# EAGLE design RN42_ BoB (EAGLE 5.10)
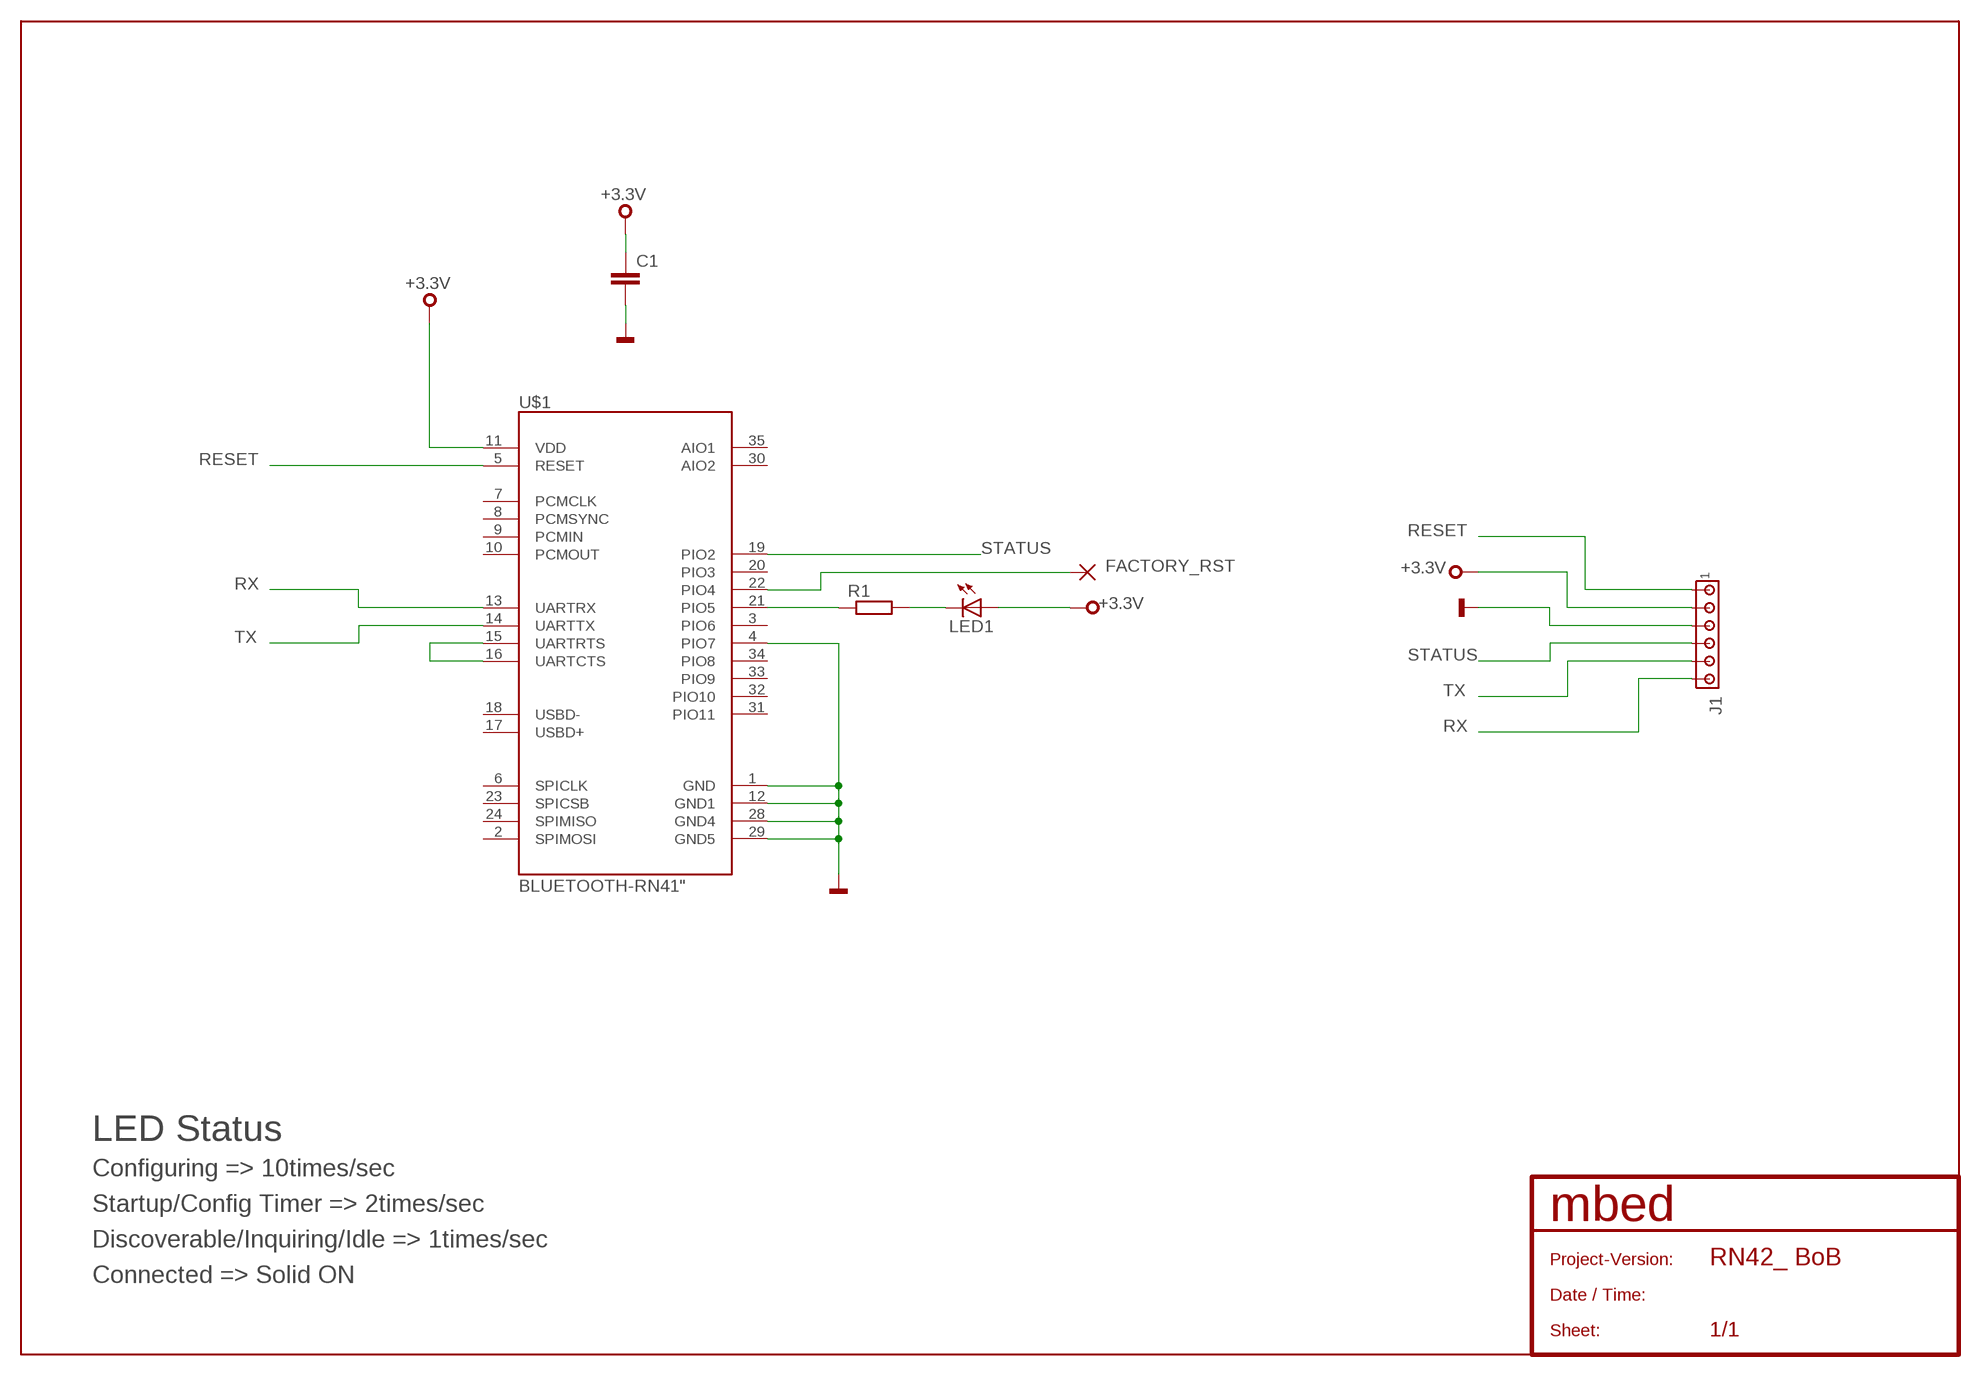
[diagram p0: schematic, sheet 1]

## Parts
C1  C-EUC0603  [C0603]
FACTORY_RST  WIREPADSMD1,27-254  [SMD1,27-2,54]
J1  MTA06-100  [10X06MTA]
LED1  LEDCHIP-LED0805  [CHIP-LED0805]
R1  R-EU_R0603  [R0603]
U$1  BLUETOOTH-RN41"  [RN41]

## Nets
+3,3V: C1.1 J1.5 LED1.A U$1.11(VDD) ; supply symbol labelled +3.3V
FACTORY_RST: FACTORY_RST.1(P) U$1.22(PIO4)
GND: C1.2 J1.4 U$1.1(GND) U$1.4(PIO7) U$1.12(GND1) U$1.28(GND4) U$1.29(GND5)
LINK: U$1.15(UARTRTS) U$1.16(UARTCTS)
N$1: LED1.C R1.2
N$2: R1.1 U$1.21(PIO5)
RESET: J1.6 U$1.5(RESET)
RX: J1.1 U$1.13(UARTRX)
STATUS: J1.3 U$1.19(PIO2)
TX: J1.2 U$1.14(UARTTX)
Unconnected: U$1.2(SPIMOSI) U$1.3(PIO6) U$1.6(SPICLK) U$1.7(PCMCLK) U$1.8(PCMSYNC) U$1.9(PCMIN) U$1.10(PCMOUT) U$1.17(USBD+) U$1.18(USBD-) U$1.20(PIO3) U$1.23(SPICSB) U$1.24(SPIMISO) U$1.30(AIO2) U$1.31(PIO11) U$1.32(PIO10) U$1.33(PIO9) U$1.34(PIO8) U$1.35(AIO1)

## Notes on the sheet
- LED Status
- Configuring => 10times/sec
- Startup/Config Timer => 2times/sec
- Discoverable/Inquiring/Idle => 1times/sec
- Connected => Solid ON

## Library data of the parts
C1 = rcl:C-EU: CAPACITOR, European symbol
FACTORY_RST = wirepad:WIREPAD: Wire PAD connect wire on PCB
J1 = con-amp:MTA06-100: AMP connector
LED1 = led:LED: LED OSRAM: - CHIPLED LG R971, LG N971, LY N971, LG Q971, LY Q971, LO R971, LY R971 LH N974, LH R974 LS Q976, LO Q976, LY Q976 LO Q996 - Hyper CHIPLED LW Q18S LB Q993, LB Q99A, LB R99A - SideLED LS A670, LO A670, LY A670, LG A670, LP A670 LB A673, LV A673, LT A673, LW A673 LH A674 LY A675 LS A676, LA A676, LO A676, LY A676, LW A676 LS A679, LY A679, LG A679 - Hyper Micro SIDELED® LS Y876, LA Y876, LO Y876, LY Y876 LT Y87S - SmartLED LW L88C, LW L88S LB L89C, LB L89S, LG L890 LS L89K, LO L89K, LY L89K LS L896, LA L896, LO L896, LY L896 - TOPLED LS T670, LO T670, LY T670, LG T670, LP T670 LSG T670, LSP T670, LSY T670, LOP T670, LYG T670 LG T671, LOG T671, LSG T671 LB T673, LV T673, LT T673, LW T673 LH T674 LS T676, LA T676, LO T676, LY T676, LB T676, LH T676, LSB T676, LW T676 LB T67C, LV T67C, LT T67C, LS T67K, LO T67K, LY T67K, LW E67C LS E67B, LA E67B, LO E67B, LY E67B, LB E67C, LV E67C, LT E67C LW T67C LS T679, LY T679, LG T679 LS T770, LO T770, LY T770, LG T770, LP T770 LB T773, LV T773, LT T773, LW T773 LH T774 LS E675, LA E675, LY E675, LS T675 LS T776, LA T776, LO T776, LY T776, LB T776 LHGB T686 LT T68C, LB T68C - Hyper Mini TOPLED® LB M676 - Mini TOPLED Santana® LG M470 LS M47K, LO M47K, LY M47K Source: http://www.osram.convergy.de LUXEON: - LUMILED® LXK2-PW12-R00, LXK2-PW12-S00, LXK2-PW14-U00, LXK2-PW14-V00 LXK2-PM12-R00, LXK2-PM12-S00, LXK2-PM14-U00 LXK2-PE12-Q00, LXK2-PE12-R00, LXK2-PE12-S00, LXK2-PE14-T00, LXK2-PE14-U00 LXK2-PB12-K00, LXK2-PB12-L00, LXK2-PB12-M00, LXK2-PB14-N00, LXK2-PB14-P00, LXK2-PB14-Q00 LXK2-PR12-L00, LXK2-PR12-M00, LXK2-PR14-Q00, LXK2-PR14-R00 LXK2-PD12-Q00, LXK2-PD12-R00, LXK2-PD12-S00 LXK2-PH12-R00, LXK2-PH12-S00 LXK2-PL12-P00, LXK2-PL12-Q00, LXK2-PL12-R00 Source: www.luxeon.com KINGBRIGHT: KA-3528ASYC Source: www.kingbright.com
R1 = rcl:R-EU_: RESISTOR, European symbol
U$1 = SparkFun:BLUETOOTH-RN41

## Board
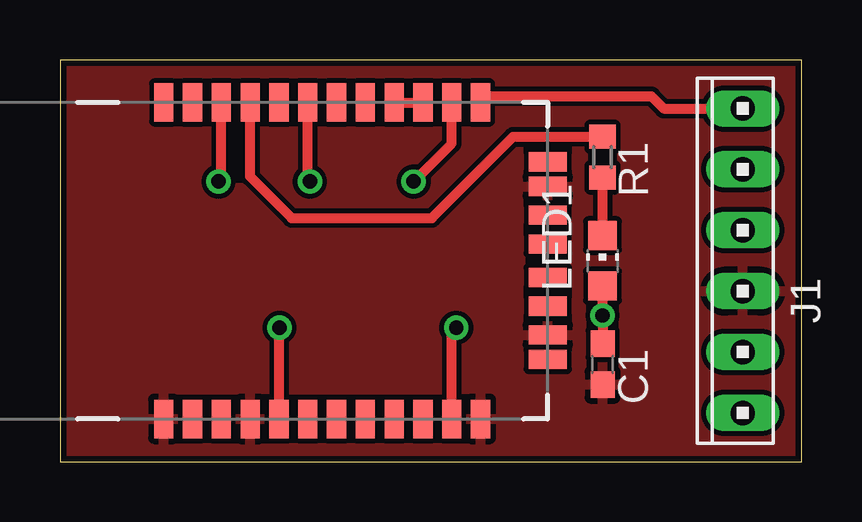
[diagram p1: board, top side]
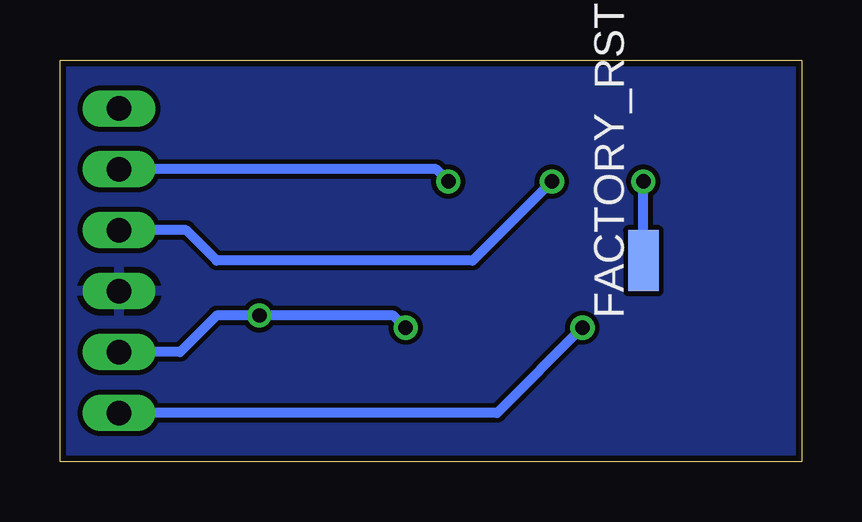
[diagram p2: board, bottom side, seen from below]

Size 30.91 x 16.75 mm. Coordinates in mm from the lower left corner, seen from the top.
Outline: 0,0 30.91,0 30.91,16.75 0,16.75 0,0
Copper layers (1*16): Top 0.035mm / dielectric 1.5mm / Bottom 0.035mm
Design rules "default *": minimum track width 10mil, minimum drill 24mil, track to track 8mil, track to pad 8mil, pad to pad 8mil, via to via 8mil, smd to smd 8mil, copper to edge 10mil, drill to drill 8mil, minimum pad ring 10mil, minimum via ring 8mil, stop-mask expansion 4mil, vias tented up to drill 0mil, thermal gap 10mil

### Footprints (pad centres in the part's own frame; a part is rotated, then mirrored left to right if it is on the bottom)
C0603 = smd 1.1 x 1: 1 -0.85,0; 2 0.85,0
SMD1,27-2,54 = smd 1.27 x 2.54: 1 0,0
10X06MTA = drill 1.016 long: 1 6.35,0; 2 3.81,0; 3 1.27,0; 4 -1.27,0; 5 -3.81,0; 6 -6.35,0
CHIP-LED0805 = smd 1.2 x 1.2: A 0,-1.05; C 0,1.05
R0603 = smd 1 x 1.1: 1 -0.85,0; 2 0.85,0
RN41 = smd 0.8 x 1.6: 1 -6.6,-6.6; 2 -5.4,-6.6; 3 -4.2,-6.6; 4 -3,-6.6; 5 -1.8,-6.6; 6 -0.6,-6.6; 7 0.6,-6.6; 8 1.8,-6.6; 9 3,-6.6; 10 4.2,-6.6; 11 5.4,-6.6; 12 6.6,-6.6; 13 6.6,6.6; 14 5.4,6.6; 15 4.2,6.6; 16 3,6.6; 17 1.8,6.6; 18 0.6,6.6; 19 -0.6,6.6; 20 -1.8,6.6; 21 -3,6.6; 22 -4.2,6.6; 23 -5.4,6.6; 24 -6.6,6.6 | smd 1.6 x 0.8: 28 9.4,3.1; 29 9.4,-3.1; 30 9.4,-4.122; 31 9.4,-1.9; 32 9.4,-0.7; 33 9.4,0.7; 34 9.4,1.9; 35 9.4,4.122

### Placement (x,y rotation side)
C1  22.61,4.06 270 top
FACTORY_RST  6.6,8.38 0 bottom
J1  28.45,8.38 90 top
LED1  22.61,8.38 0 top
R1  22.61,12.7 270 top
U$1  10.92,8.38 0 top

### Tracks (layer width: path | path; a pad name or v marks a point on that pad's centre or on a via)
+3,3V  (via drill 0.6)
  Top 0.406: C1.1 v22.61,6.1 LED1.A | v16.51,5.59 16.32,5.4 U$1.11
  Bottom 0.406: v16.51,5.59 17.02,6.1 v22.61,6.1 24.38,6.1 25.91,4.57 J1.5
FACTORY_RST  (via drill 0.6)
  Top 0.406: v6.6,11.68 6.72,11.8 U$1.22
  Bottom 0.406: FACTORY_RST.1 v6.6,11.68
GND
  pour Top: -0.51,18.29 31.24,18.29 31.24,-1.52 -0.51,-1.52
  pour Bottom: -0.51,17.78 -0.51,-0.76 31.24,-0.76 31.24,17.78
LINK
  Top 0.406: U$1.16 U$1.15
N$1
  Top 0.406: LED1.C R1.2
N$2
  Top 0.406: R1.1 18.88,13.55 15.49,10.16 9.65,10.16 7.92,11.89 U$1.21
RESET  (via drill 0.6)
  Top 0.406: U$1.5 9.14,1.78 v9.14,5.59
  Bottom 0.406: J1.6 12.7,2.03 v9.14,5.59
RX
  Top 0.406: J1.1 25.15,14.73 24.64,15.24 17.52,15.24 U$1.13
STATUS  (via drill 0.6)
  Top 0.406: v10.41,11.68 10.32,11.78 U$1.19
  Bottom 0.406: v10.41,11.68 13.72,8.38 24.38,8.38 25.65,9.65 J1.3
TX  (via drill 0.6)
  Top 0.406: U$1.14 16.32,13.27 v14.73,11.68
  Bottom 0.406: v14.73,11.68 15.24,12.19 J1.2

### Text on the board
Document: RX | TX | STA | GND | 3.3V | nRST | RN-42